# EasyEDA Pro project ProPrj_Arduino Project_2026-04-11 (1).epro

# Schematic Schematic1
Board Name: Board1; Create Date: 2026-04-10; Page Name: P1; Project Name: Arduino Project; Schematic Name: Schematic1; Update Date: 2026-04-10; Company: EasyEDA.com; Page Size: A4; Version: V1.0
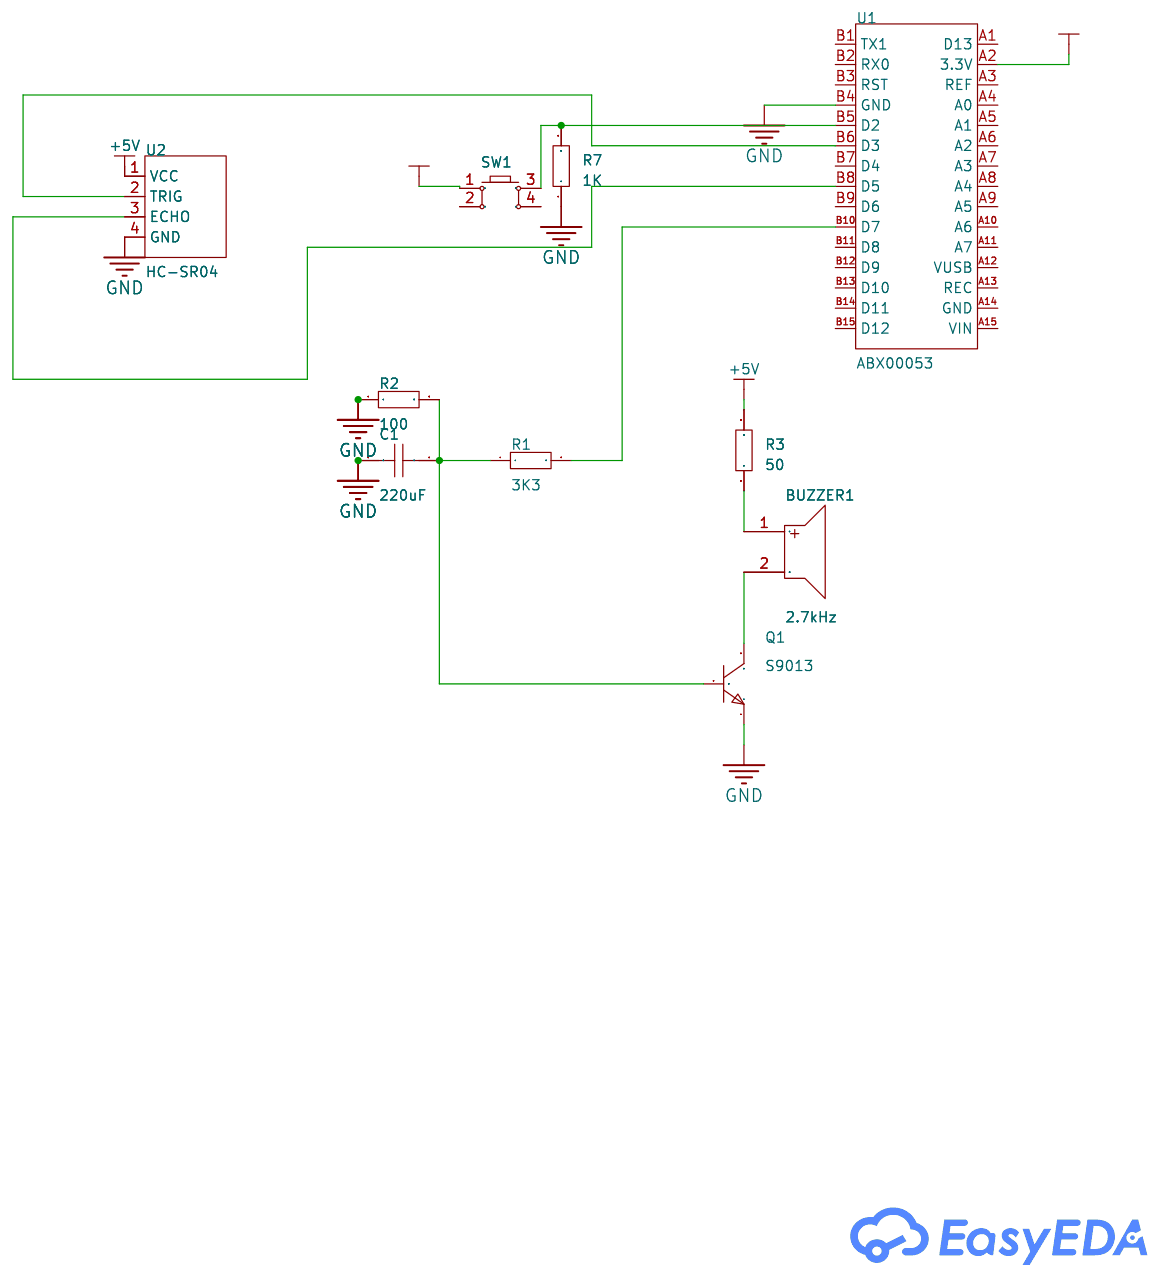
[diagram p0: schematic sheet]

## Parts
BUZZER1  2.7kHz  [BUZ-TH_BD9.0-P4.00-D0.6-FD]
C1  220uF  [C0201]
Q1  S9013  [TO-92-3_L4.5-W3.5-P1.27-L]
R1  3K3  [R0603]
R2  100  [R0603]
R3  50  [R0603]
R7  1K  [R0603]
SW1  -  [SW-SMD_4P-L6.0-W6.0-P4.50-LS9.0-2]
U1  ABX00053  [COMM-TH_ABX00092]
U2  HC-SR04  [TH_HC-SR04V]

## Library data of the parts
BUZZER1 = QMB-09B-03: Driver Circuitry:Passive (Externally Driven) Technology:Electromagnetic Voltage - Supply:2V~5V Voltage - Supply:2V~5V Frequency:2.7kHz Sound Pressure Level(SPL):85dB Diameter(φD):9mm Height:5.7mm; LCSC Part Name: 无源蜂鸣器QMB-09B-03; Supplier Part: C96256; Manufacturer: 华能; Supplier Footprint: 插件,D=9mm; JLCPCB Part Class: 扩展库; Datasheet: https://item.szlcsc.com/datasheet/QMB-09B-03/97460.html; Supplier: LCSC; Driver Circuitry: Passive (Externally Driven); Technology: Electromagnetic; Voltage - Supply: 2V~5V; Sound Pressure Level(SPL): 85dB; Diameter(φD): 9mm; Height: 5.7mm
C1 = CAP_0201: Supplier Footprint: 0201
Q1 = S9013_C20616377: type:NPN Current - Collector(Ic):500mA DC Current Gain:300 DC Current Gain:300 Transition frequency(fT):150MHz; Supplier Part: C20616377; Manufacturer: HXY MOSFET(华轩阳电子); Supplier Footprint: TO-92; JLCPCB Part Class: 扩展库; Datasheet: https://item.szlcsc.com/datasheet/S9013/21982892.html; Supplier: LCSC; type: NPN; Current - Collector(Ic): 500mA; DC Current Gain: 300; Transition frequency(fT): 150MHz
R1-R3 R7 = Res_0603: Supplier Footprint: 0603
SW1 = Key_SMD_6x6x6.5: Supplier Footprint: SMD
U1 = ABX00053: Supplier Part: C22392413; Manufacturer: arduino; JLCPCB Part Class: 扩展库; Datasheet: https://item.szlcsc.com/datasheet/ABX00053/23980138.html; Supplier: LCSC
U2 = HC-SR04: Supplier Part: C19857336; Manufacturer: Universal Microelectronics; JLCPCB Part Class: 扩展库; Datasheet: https://item.szlcsc.com/datasheet/HC-SR04/21184790.html; Supplier: LCSC

## Nets
3.3V: U1.A2(3.3V)
5V: SW1.1
+5V: R3.2 U2.1(VCC)
GND: C1.2 Q1.1(E) R2.1 R7.1 U1.B4(GND) U2.4(GND)
Net-(BUZZER1-1): BUZZER1.1 R3.1
Net-(BUZZER1-2): BUZZER1.2 Q1.3(C)
Net-(C1-1): C1.1 Q1.2(B) R1.1 R2.2
Net-(R1-2): R1.2 U1.B10(D7)
Net-(R7-2): R7.2 SW1.3 U1.B5(D2)
Net-(U1-B6): U1.B6(D3) U2.2(TRIG)
Net-(U1-B8): U1.B8(D5) U2.3(ECHO)

Not connected (* = marked no-connect by the designer): SW1 2 4; U1 A1(D13) A3(REF) A4(A0) A5(A1) A6(A2) A7(A3) A8(A4) A9(A5) A10(A6) A11(A7) A12(VUSB) A13(REC) A14(GND) A15(VIN) B1(TX1) B2(RX0) B3(RST) B7(D4) B9(D6) B11(D8) B12(D9) B13(D10) B14(D11) B15(D12)
